# Altium schematic sheet Power.SchDoc
size A4
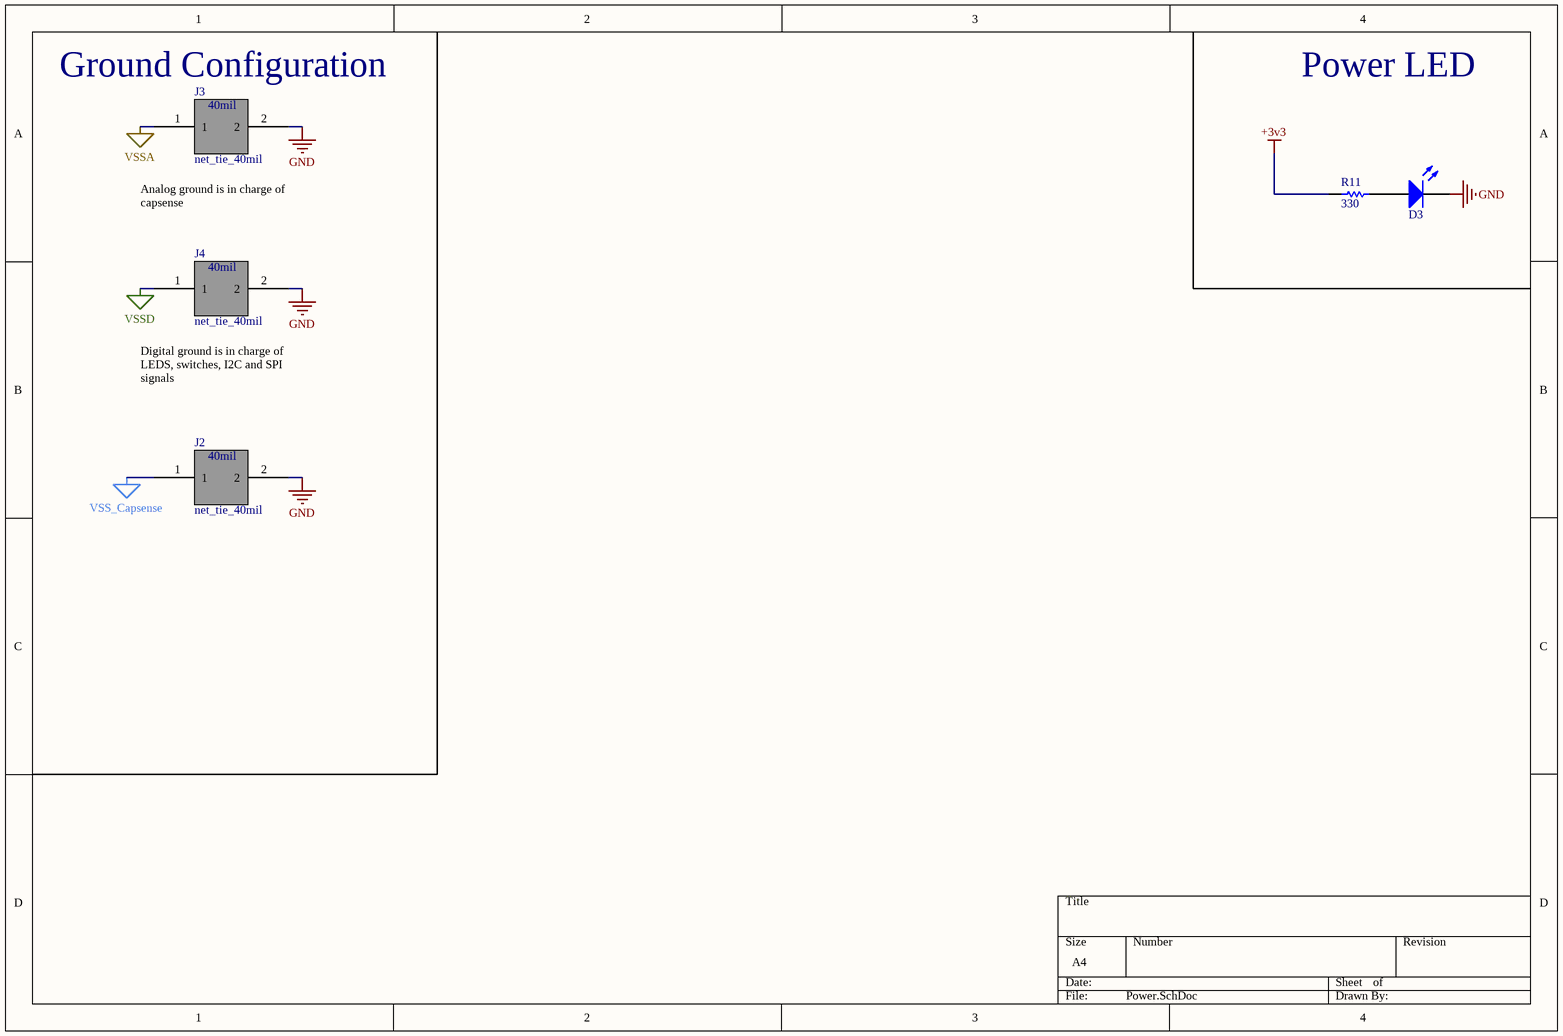
[diagram p0: Power.SchDoc]

## Parts
D3  150060BS75000  [0603_A]  (value not drawn)
J2  net_tie_40mil  [net_tie]  (net tie, no BOM)
J3  net_tie_40mil  [net_tie]  (net tie, no BOM)
J4  net_tie_40mil  [net_tie]  (net tie, no BOM)
R11  330  [RESC0603(1608)_L]

## Nets
+3v3: R11.1
GND: D3.1(K) J2.2 J3.2 J4.2
VSS_Capsense: J2.1
VSSA: J3.1
VSSD: J4.1
NetD3_2: D3.2(A) R11.2

## Notes on the sheet
- (near J3) Ground Configuration
- Power LED
- (near J4) Analog ground is in charge of capsense
- Digital ground is in charge of LEDS, switches, I2C and SPI signals
- (in symbol net_tie_40mil) 40mil

## Library data of the parts
D3 = CMP-1426-00003-1: SMD mono-color Chip LED, WL-SMCW, Blue; Manufacturer: Wuerth Elektronik; Color: Blue; ComponentLink2Description: Datasheet; ComponentLink2URL: http://katalog.we-online.com/led/datasheet/150060BS75000.pdf; ComponentLink1URL: http://www.we-online.com; PackageReference: 0603_A; PartNumber: 150060BS75000; ComponentLink1Description: Manufacturer URL
R11 = CMP-1012-00062-1: 330R 0.1W 5% 0603 (1608 Metric)  SMD; Value: 330.00 Ohm; Case-EIA: 0603; Case-Metric: 1608; Tolerance: 5 %; Power: 0.1 W; Technology: SMT